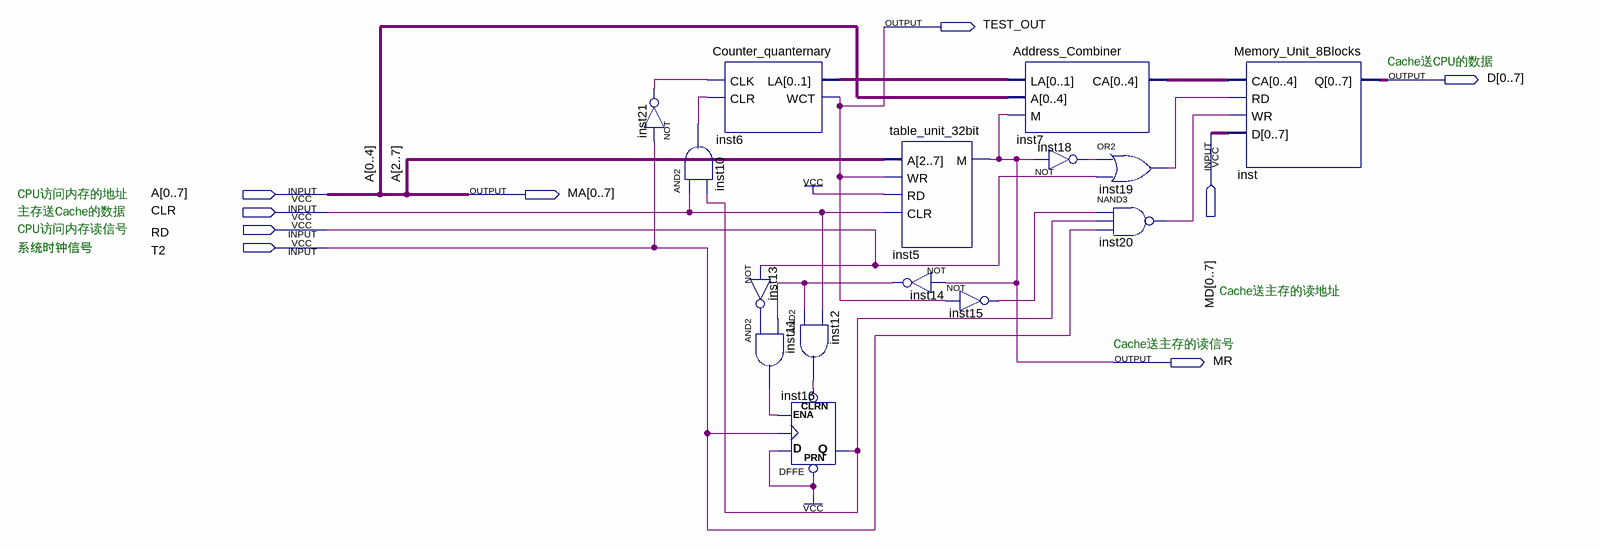
[diagram p0: schematic sheet]
// Quartus schematic THE_CACHE.bdf as structural Verilog: 15 symbols, 9 pins
module THE_CACHE (
  input  [0:7] MD,
  input  [0:7] A,
  input  CLR,
  input  RD,
  input  T2,
  output TEST_OUT,
  output [0:7] D,
  output [0:7] MA,
  output MR
);

  wire inst10_out, inst11_out, inst12_out, inst13_out, inst14_out, inst15_out, inst16_q, inst18_out,
       inst19_out, inst20_out, inst21_out;
  wire [1:0] inst6_la;
  wire [4:0] inst7_ca;

  not inst21 (inst21_out, T2);
  and inst10 (inst10_out, CLR, inst16_q);
  Counter_quanternary inst6 (.CLK(inst21_out), .CLR(inst10_out), .LA(inst6_la), .WCT(TEST_OUT));
  not inst13 (inst13_out, RD);
  and inst11 (inst11_out, inst13_out, inst14_out);
  and inst12 (inst12_out, inst14_out, CLR);
  DFFE inst16 (.PRN(1'b1), .CLRN(inst12_out), .D(1'b1), .CLK(T2), .ENA(inst11_out), .Q(inst16_q));
  table_unit_32bit inst5 (.A(A[2:7]), .WR(TEST_OUT), .RD(1'b1), .CLR(CLR), .M(MR));
  not inst14 (inst14_out, MR);
  not inst15 (inst15_out, TEST_OUT);
  Address_Combiner inst7 (.LA(inst6_la), .A(A[0:4]), .M(MR), .CA(inst7_ca));
  not inst18 (inst18_out, MR);
  or inst19 (inst19_out, inst18_out, RD);
  nand inst20 (inst20_out, inst15_out, inst16_q, T2);
  Memory_Unit_8Blocks inst (.CA(inst7_ca), .RD(inst19_out), .WR(inst20_out), .D(MD), .Q(D));

  assign MA = A;

  // Notes on the sheet:
  //   Cache送CPU的数据
  //   CPU访问内存的地址
  //   主存送Cache的数据
  //   CPU访问内存读信号
  //   系统时钟信号
  //   Cache送主存的读地址
  //   Cache送主存的读信号
endmodule
